# Altium schematic sheet MOTHERBOARD_NEW.SCHDOC: MOTHERBOARD
size A4; DocumentNumber: 3; Revision: 1.8.2; SheetNumber: 3; SheetTotal: 19
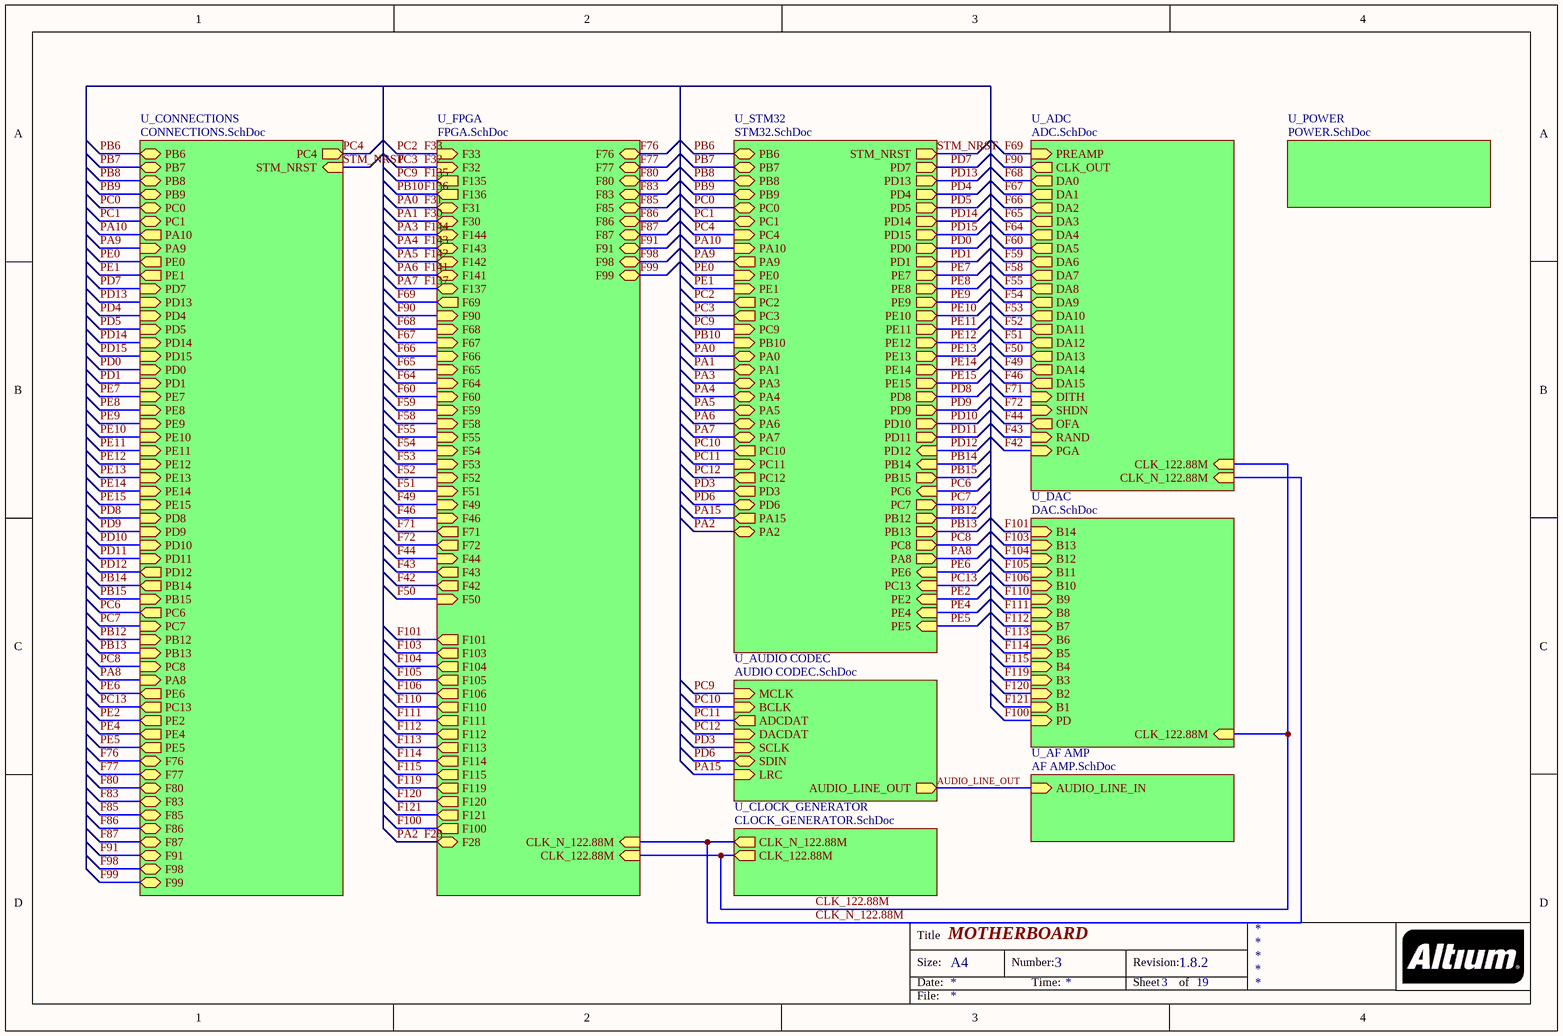
[diagram p0: MOTHERBOARD_NEW.SCHDOC]

## Sub-sheets
U_ADC = ADC.SchDoc: PREAMP (in), CLK_OUT (out), DA0 (out), DA1 (out), DA2 (out), DA3 (out), DA4 (out), DA5 (out), DA6 (out), DA7 (out), DA8 (out), DA9 (out), DA10 (out), DA11 (out), DA12 (out), DA14 (out), DA15 (out), DITH (in), SHDN (in), OFA (out), RAND (in), PGA (in), DA13 (out), CLK_122.88M (in), CLK_N_122.88M (in)
U_AF AMP = AF AMP.SchDoc: AUDIO_LINE_IN (in)
U_AUDIO CODEC = AUDIO CODEC.SchDoc: AUDIO_LINE_OUT (out), MCLK (in), BCLK (in), ADCDAT (out), DACDAT (in), SCLK (in), SDIN (bidir), LRC (in)
U_CLOCK_GENERATOR = CLOCK_GENERATOR.SchDoc: CLK_N_122.88M (out), CLK_122.88M (out)
U_CONNECTIONS = CONNECTIONS.SchDoc: PB6 (bidir), PB7 (bidir), PB8 (bidir), PB9 (bidir), PC0 (bidir), PC1 (bidir), PC4 (out), PA10 (out), PA9 (in), PE0 (out), PE1 (out), STM_NRST (in), PD7 (in), PD13 (in), PD4 (in), PD5 (in), PD14 (in), PD15 (in), PD0 (in), PD1 (in), PE7 (in), PE8 (in), PE9 (in), PE10 (in), PE11 (in), PE12 (in), PE13 (in), PE14 (in), PE15 (in), PD8 (in), PD9 (in), PD10 (in), PD11 (in), PD12 (out), PB14 (out), PB15 (in), PC6 (out), PC7 (in), PB12 (in), PB13 (in), PC8 (in), PA8 (in), PE6 (out), PC13 (out), PE2 (out), PE4 (out), PE5 (out), F76 (bidir), F77 (bidir), F80 (bidir), F83 (bidir), F85 (bidir), F86 (bidir), F87 (bidir), F91 (bidir), F98 (bidir), F99 (bidir)
U_DAC = DAC.SchDoc: B14 (in), B13 (in), B12 (in), B11 (in), B10 (in), B9 (in), B8 (in), B7 (in), B6 (in), B5 (in), B4 (in), B3 (in), B2 (in), B1 (in), PD (in), CLK_122.88M (in)
U_FPGA = FPGA.SchDoc: F33 (in), F32 (in), F135 (out), F136 (out), F31 (bidir), F30 (bidir), F144 (bidir), F143 (bidir), F142 (bidir), F141 (bidir), F137 (bidir), F76 (bidir), F77 (bidir), F80 (bidir), F83 (bidir), F85 (bidir), F86 (bidir), F87 (bidir), F91 (bidir), F98 (bidir), F99 (bidir), F69 (out), F90 (in), F68 (in), F67 (in), F66 (in), F65 (in), F64 (in), F60 (in), F59 (in), F58 (in), F55 (in), F54 (in), F53 (in), F52 (in), F51 (in), F49 (in), F46 (in), F71 (out), F72 (out), F44 (in), F43 (out), F42 (out), F50 (in), CLK_122.88M (in), CLK_N_122.88M (in), F101 (out), F103 (out), F104 (out), F105 (out), F106 (out), F110 (out), F111 (out), F112 (out), F113 (out), F114 (out), F115 (out), F119 (out), F120 (out), F121 (out), F100 (out), F28 (bidir)
U_POWER = POWER.SchDoc: no entries
U_STM32 = STM32.SchDoc: PB6 (bidir), PB7 (bidir), PB8 (bidir), PB9 (bidir), PC0 (bidir), PC1 (bidir), PC4 (in), PA10 (in), PA9 (out), PE0 (in), PE1 (in), STM_NRST (out), PD7 (out), PD13 (out), PD4 (out), PD5 (out), PD14 (out), PD15 (out), PD0 (out), PD1 (out), PE7 (out), PE8 (out), PE9 (out), PE10 (out), PE11 (out), PE12 (out), PE13 (out), PE14 (out), PE15 (out), PD8 (out), PD9 (out), PD10 (out), PD11 (out), PD12 (in), PB14 (in), PB15 (out), PC6 (in), PC7 (out), PB12 (out), PB13 (out), PC8 (out), PA8 (out), PE6 (in), PC13 (in), PE2 (in), PE4 (in), PE5 (in), PC2 (out), PC3 (out), PC9 (in), PB10 (in), PA0 (bidir), PA1 (bidir), PA3 (bidir), PA4 (bidir), PA5 (bidir), PA6 (bidir), PA7 (bidir), PC10 (out), PC11 (in), PC12 (out), PD3 (out), PD6 (bidir), PA15 (out), PA2 (bidir)

## Nets
AUDIO_LINE_OUT: sheet U_AF AMP/AUDIO_LINE_IN, sheet U_AUDIO CODEC/AUDIO_LINE_OUT
CLK_122.88M: sheet U_DAC/CLK_122.88M, sheet U_ADC/CLK_122.88M, sheet U_CLOCK_GENERATOR/CLK_122.88M, sheet U_FPGA/CLK_122.88M
CLK_N_122.88M: sheet U_ADC/CLK_N_122.88M, sheet U_CLOCK_GENERATOR/CLK_N_122.88M, sheet U_FPGA/CLK_N_122.88M
F28: sheet U_FPGA/F28, sheet U_STM32/PA2  [also labelled PA2]
F30: sheet U_FPGA/F30, sheet U_STM32/PA1  [also labelled PA1]
F31: sheet U_FPGA/F31, sheet U_STM32/PA0  [also labelled PA0]
F32: sheet U_FPGA/F32, sheet U_STM32/PC3  [also labelled PC3]
F33: sheet U_FPGA/F33, sheet U_STM32/PC2  [also labelled PC2]
F42: sheet U_ADC/PGA, sheet U_FPGA/F42
F43: sheet U_ADC/RAND, sheet U_FPGA/F43
F44: sheet U_ADC/OFA, sheet U_FPGA/F44
F46: sheet U_ADC/DA15, sheet U_FPGA/F46
F49: sheet U_ADC/DA14, sheet U_FPGA/F49
F50: sheet U_ADC/DA13, sheet U_FPGA/F50
F51: sheet U_ADC/DA12, sheet U_FPGA/F51
F52: sheet U_ADC/DA11, sheet U_FPGA/F52
F53: sheet U_ADC/DA10, sheet U_FPGA/F53
F54: sheet U_ADC/DA9, sheet U_FPGA/F54
F55: sheet U_ADC/DA8, sheet U_FPGA/F55
F58: sheet U_ADC/DA7, sheet U_FPGA/F58
F59: sheet U_ADC/DA6, sheet U_FPGA/F59
F60: sheet U_ADC/DA5, sheet U_FPGA/F60
F64: sheet U_ADC/DA4, sheet U_FPGA/F64
F65: sheet U_ADC/DA3, sheet U_FPGA/F65
F66: sheet U_ADC/DA2, sheet U_FPGA/F66
F67: sheet U_ADC/DA1, sheet U_FPGA/F67
F68: sheet U_ADC/DA0, sheet U_FPGA/F68
F69: sheet U_ADC/PREAMP, sheet U_FPGA/F69
F71: sheet U_ADC/DITH, sheet U_FPGA/F71
F72: sheet U_ADC/SHDN, sheet U_FPGA/F72
F76: sheet U_CONNECTIONS/F76, sheet U_FPGA/F76
F77: sheet U_CONNECTIONS/F77, sheet U_FPGA/F77
F80: sheet U_CONNECTIONS/F80, sheet U_FPGA/F80
F83: sheet U_CONNECTIONS/F83, sheet U_FPGA/F83
F85: sheet U_CONNECTIONS/F85, sheet U_FPGA/F85
F86: sheet U_CONNECTIONS/F86, sheet U_FPGA/F86
F87: sheet U_CONNECTIONS/F87, sheet U_FPGA/F87
F90: sheet U_ADC/CLK_OUT, sheet U_FPGA/F90
F91: sheet U_CONNECTIONS/F91, sheet U_FPGA/F91
F98: sheet U_CONNECTIONS/F98, sheet U_FPGA/F98
F99: sheet U_CONNECTIONS/F99, sheet U_FPGA/F99
F100: sheet U_DAC/PD, sheet U_FPGA/F100
F101: sheet U_DAC/B14, sheet U_FPGA/F101
F103: sheet U_DAC/B13, sheet U_FPGA/F103
F104: sheet U_DAC/B12, sheet U_FPGA/F104
F105: sheet U_DAC/B11, sheet U_FPGA/F105
F106: sheet U_DAC/B10, sheet U_FPGA/F106
F110: sheet U_DAC/B9, sheet U_FPGA/F110
F111: sheet U_DAC/B8, sheet U_FPGA/F111
F112: sheet U_DAC/B7, sheet U_FPGA/F112
F113: sheet U_DAC/B6, sheet U_FPGA/F113
F114: sheet U_DAC/B5, sheet U_FPGA/F114
F115: sheet U_DAC/B4, sheet U_FPGA/F115
F119: sheet U_DAC/B3, sheet U_FPGA/F119
F120: sheet U_DAC/B2, sheet U_FPGA/F120
F121: sheet U_DAC/B1, sheet U_FPGA/F121
F135: sheet U_AUDIO CODEC/MCLK, sheet U_FPGA/F135, sheet U_STM32/PC9  [also labelled PC9]
F136: sheet U_FPGA/F136, sheet U_STM32/PB10  [also labelled PB10]
F137: sheet U_FPGA/F137, sheet U_STM32/PA7  [also labelled PA7]
F141: sheet U_FPGA/F141, sheet U_STM32/PA6  [also labelled PA6]
F142: sheet U_FPGA/F142, sheet U_STM32/PA5  [also labelled PA5]
F143: sheet U_FPGA/F143, sheet U_STM32/PA4  [also labelled PA4]
F144: sheet U_FPGA/F144, sheet U_STM32/PA3  [also labelled PA3]
PA8: sheet U_CONNECTIONS/PA8, sheet U_STM32/PA8
PA9: sheet U_CONNECTIONS/PA9, sheet U_STM32/PA9
PA10: sheet U_CONNECTIONS/PA10, sheet U_STM32/PA10
PA15: sheet U_AUDIO CODEC/LRC, sheet U_STM32/PA15
PB6: sheet U_CONNECTIONS/PB6, sheet U_STM32/PB6
PB7: sheet U_CONNECTIONS/PB7, sheet U_STM32/PB7
PB8: sheet U_CONNECTIONS/PB8, sheet U_STM32/PB8
PB9: sheet U_CONNECTIONS/PB9, sheet U_STM32/PB9
PB12: sheet U_CONNECTIONS/PB12, sheet U_STM32/PB12
PB13: sheet U_CONNECTIONS/PB13, sheet U_STM32/PB13
PB14: sheet U_CONNECTIONS/PB14, sheet U_STM32/PB14
PB15: sheet U_CONNECTIONS/PB15, sheet U_STM32/PB15
PC0: sheet U_CONNECTIONS/PC0, sheet U_STM32/PC0
PC1: sheet U_CONNECTIONS/PC1, sheet U_STM32/PC1
PC4: sheet U_CONNECTIONS/PC4, sheet U_STM32/PC4
PC6: sheet U_CONNECTIONS/PC6, sheet U_STM32/PC6
PC7: sheet U_CONNECTIONS/PC7, sheet U_STM32/PC7
PC8: sheet U_CONNECTIONS/PC8, sheet U_STM32/PC8
PC10: sheet U_AUDIO CODEC/BCLK, sheet U_STM32/PC10
PC11: sheet U_AUDIO CODEC/ADCDAT, sheet U_STM32/PC11
PC12: sheet U_AUDIO CODEC/DACDAT, sheet U_STM32/PC12
PC13: sheet U_CONNECTIONS/PC13, sheet U_STM32/PC13
PD0: sheet U_CONNECTIONS/PD0, sheet U_STM32/PD0
PD1: sheet U_CONNECTIONS/PD1, sheet U_STM32/PD1
PD3: sheet U_AUDIO CODEC/SCLK, sheet U_STM32/PD3
PD4: sheet U_CONNECTIONS/PD4, sheet U_STM32/PD4
PD5: sheet U_CONNECTIONS/PD5, sheet U_STM32/PD5
PD6: sheet U_AUDIO CODEC/SDIN, sheet U_STM32/PD6
PD7: sheet U_CONNECTIONS/PD7, sheet U_STM32/PD7
PD8: sheet U_CONNECTIONS/PD8, sheet U_STM32/PD8
PD9: sheet U_CONNECTIONS/PD9, sheet U_STM32/PD9
PD10: sheet U_CONNECTIONS/PD10, sheet U_STM32/PD10
PD11: sheet U_CONNECTIONS/PD11, sheet U_STM32/PD11
PD12: sheet U_CONNECTIONS/PD12, sheet U_STM32/PD12
PD13: sheet U_CONNECTIONS/PD13, sheet U_STM32/PD13
PD14: sheet U_CONNECTIONS/PD14, sheet U_STM32/PD14
PD15: sheet U_CONNECTIONS/PD15, sheet U_STM32/PD15
PE0: sheet U_CONNECTIONS/PE0, sheet U_STM32/PE0
PE1: sheet U_CONNECTIONS/PE1, sheet U_STM32/PE1
PE2: sheet U_CONNECTIONS/PE2, sheet U_STM32/PE2
PE4: sheet U_CONNECTIONS/PE4, sheet U_STM32/PE4
PE5: sheet U_CONNECTIONS/PE5, sheet U_STM32/PE5
PE6: sheet U_CONNECTIONS/PE6, sheet U_STM32/PE6
PE7: sheet U_CONNECTIONS/PE7, sheet U_STM32/PE7
PE8: sheet U_CONNECTIONS/PE8, sheet U_STM32/PE8
PE9: sheet U_CONNECTIONS/PE9, sheet U_STM32/PE9
PE10: sheet U_CONNECTIONS/PE10, sheet U_STM32/PE10
PE11: sheet U_CONNECTIONS/PE11, sheet U_STM32/PE11
PE12: sheet U_CONNECTIONS/PE12, sheet U_STM32/PE12
PE13: sheet U_CONNECTIONS/PE13, sheet U_STM32/PE13
PE14: sheet U_CONNECTIONS/PE14, sheet U_STM32/PE14
PE15: sheet U_CONNECTIONS/PE15, sheet U_STM32/PE15
STM_NRST: sheet U_CONNECTIONS/STM_NRST, sheet U_STM32/STM_NRST

## Notes on the sheet
- Title
- Size:
- Date:
- A4
- Number:
- Time:
- Revision:
- Sheet
- of
- File: